# EasyEDA Pro project modern-cadet-v2.eprj, schematic key-socket
Board Name: key-socket; Create Date: 2025-07-12; Page Name: P1; Project Name: key-socket; Schematic Name: key-socket; Update Date: 2025-07-12; Company: EasyEDA.com; Page Size: A4; Version: V1.0
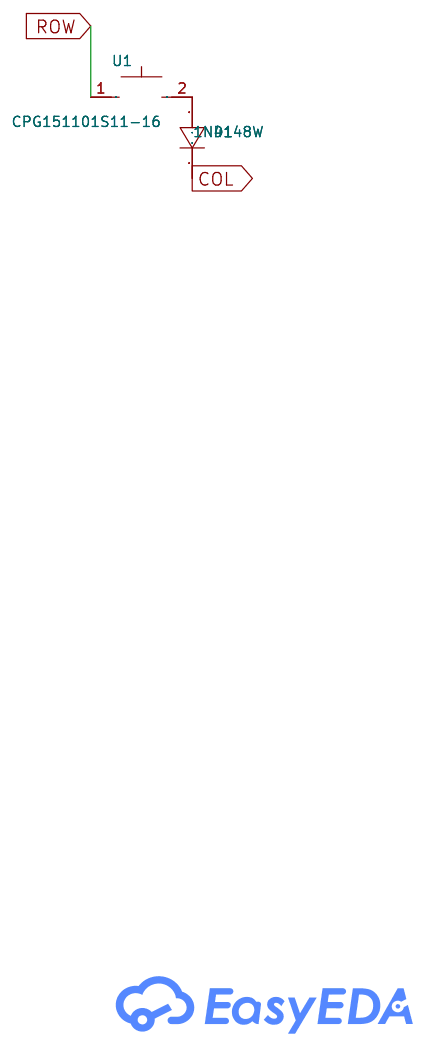
[diagram p3: schematic sheet]

## Parts
D1  1N4148W  [SOD-123F_L2.7-W1.6-LS3.8-RD]
U1  CPG151101S11-16  [SMD_KEYBOARD-SW]

## Library data of the parts
D1 = 1N4148W_C81598: Diode Configuration:Independent Type Forward Voltage (Vf@If):1V@50mA Reverse Voltage (Vr): Rectified Current: Reverse Leakage Current (Ir):1uA@75V Reverse Recovery Time (trr): Operating Temperature:- Operating Temperature:-; Supplier Part: C81598; Manufacturer: ST(先科); Supplier Footprint: SOD-123; JLCPCB Part Class: Basic Part; Datasheet: https://atta.szlcsc.com/upload/public/pdf/source/20161024/1477288446905.pdf; Supplier: LCSC; Diode Configuration: Independent Type; Forward Voltage (Vf@If): 1V@50mA; Reverse Leakage Current (Ir): 1uA@75V
U1 = CPG151101S11-16_C41430893: LCSC Part Name: 热插拔底座连接器 键盘配件; Supplier Part: C41430893; Manufacturer: HanElectricity(瀚源); Supplier Footprint: SMD,14.5x5.9mm; JLCPCB Part Class: Extended Part; Datasheet: https://atta.szlcsc.com/upload/public/pdf/source/20241016/CAB9C3DABBAD4306660C041376EEF732.pdf; Supplier: LCSC

## Nets
COL: D1.1(K)
ROW: U1.1
$1N478: D1.2(A) U1.2
